# EAGLE schematic ecg_2017 (EAGLE 7.6.0)
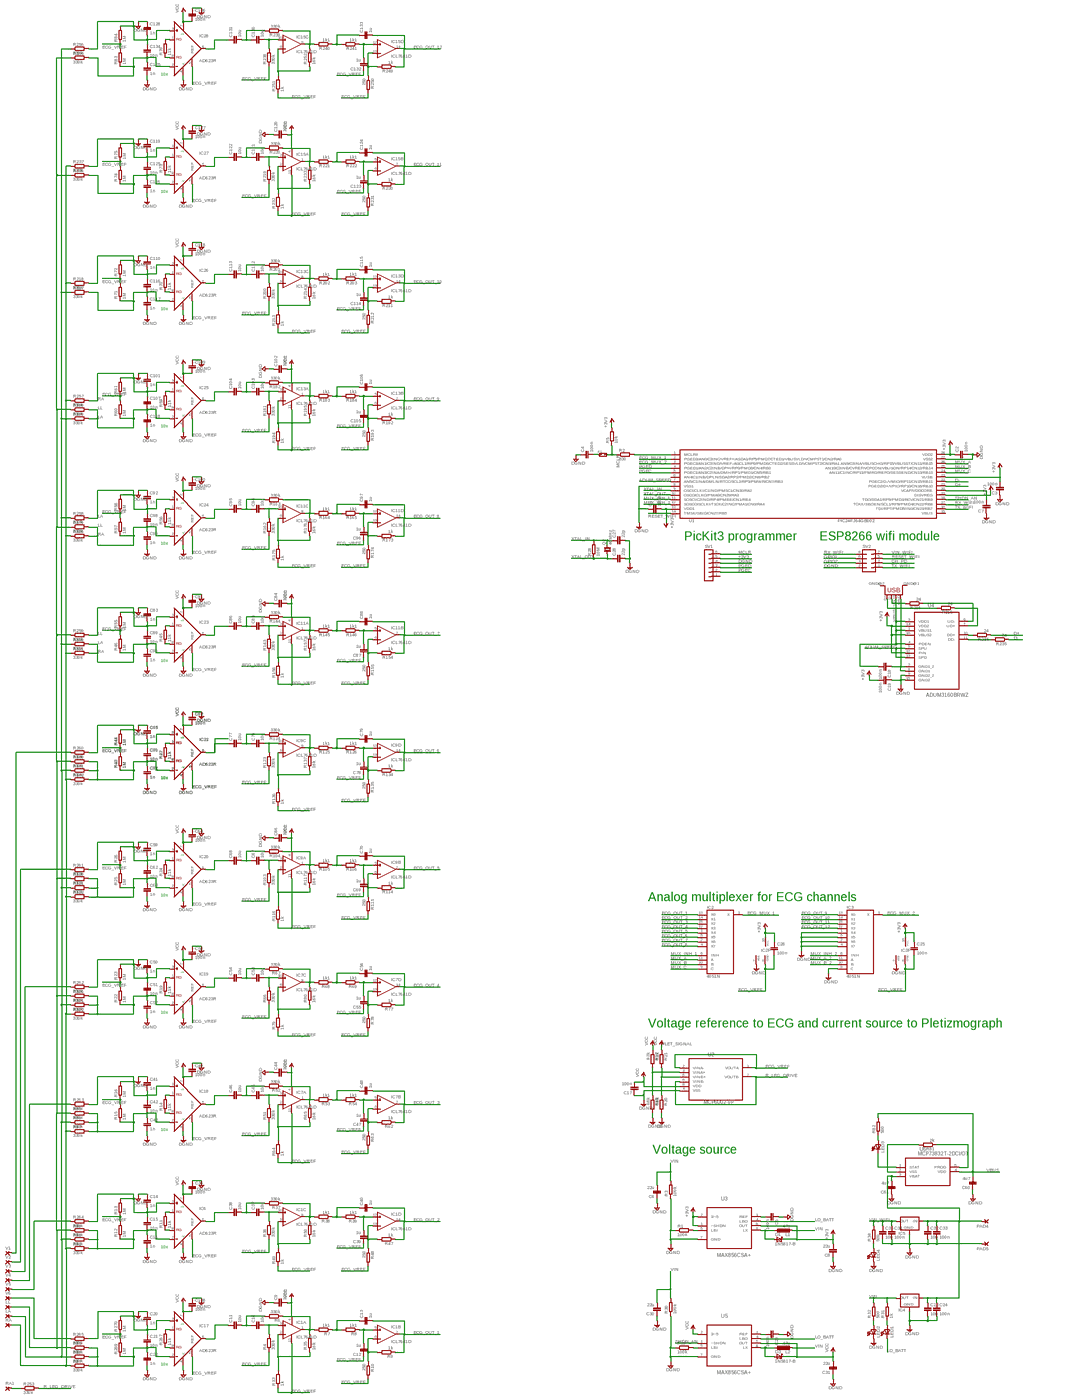
[diagram p0: schematic, sheet 1, overview]
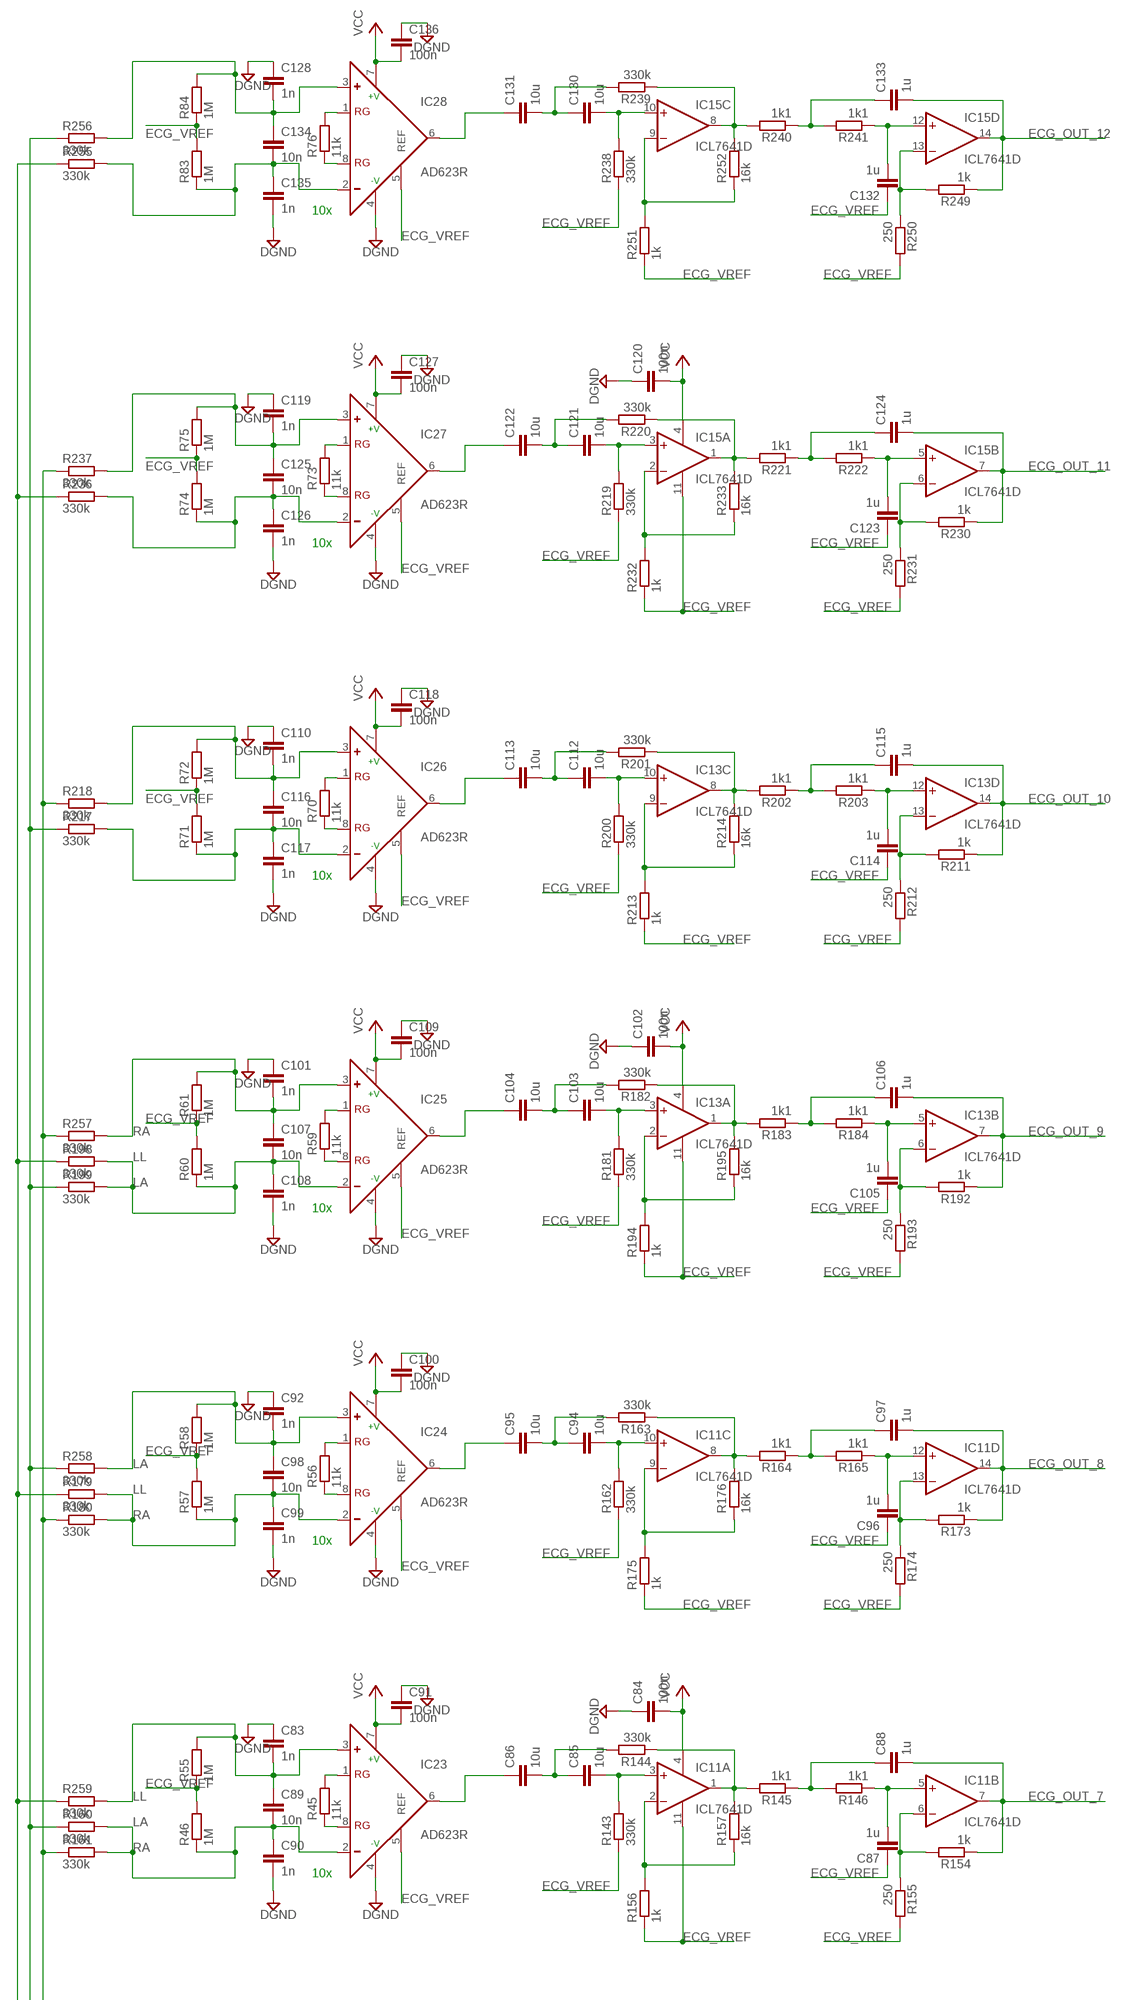
[diagram p1: schematic, sheet 1, part 1 of 4]
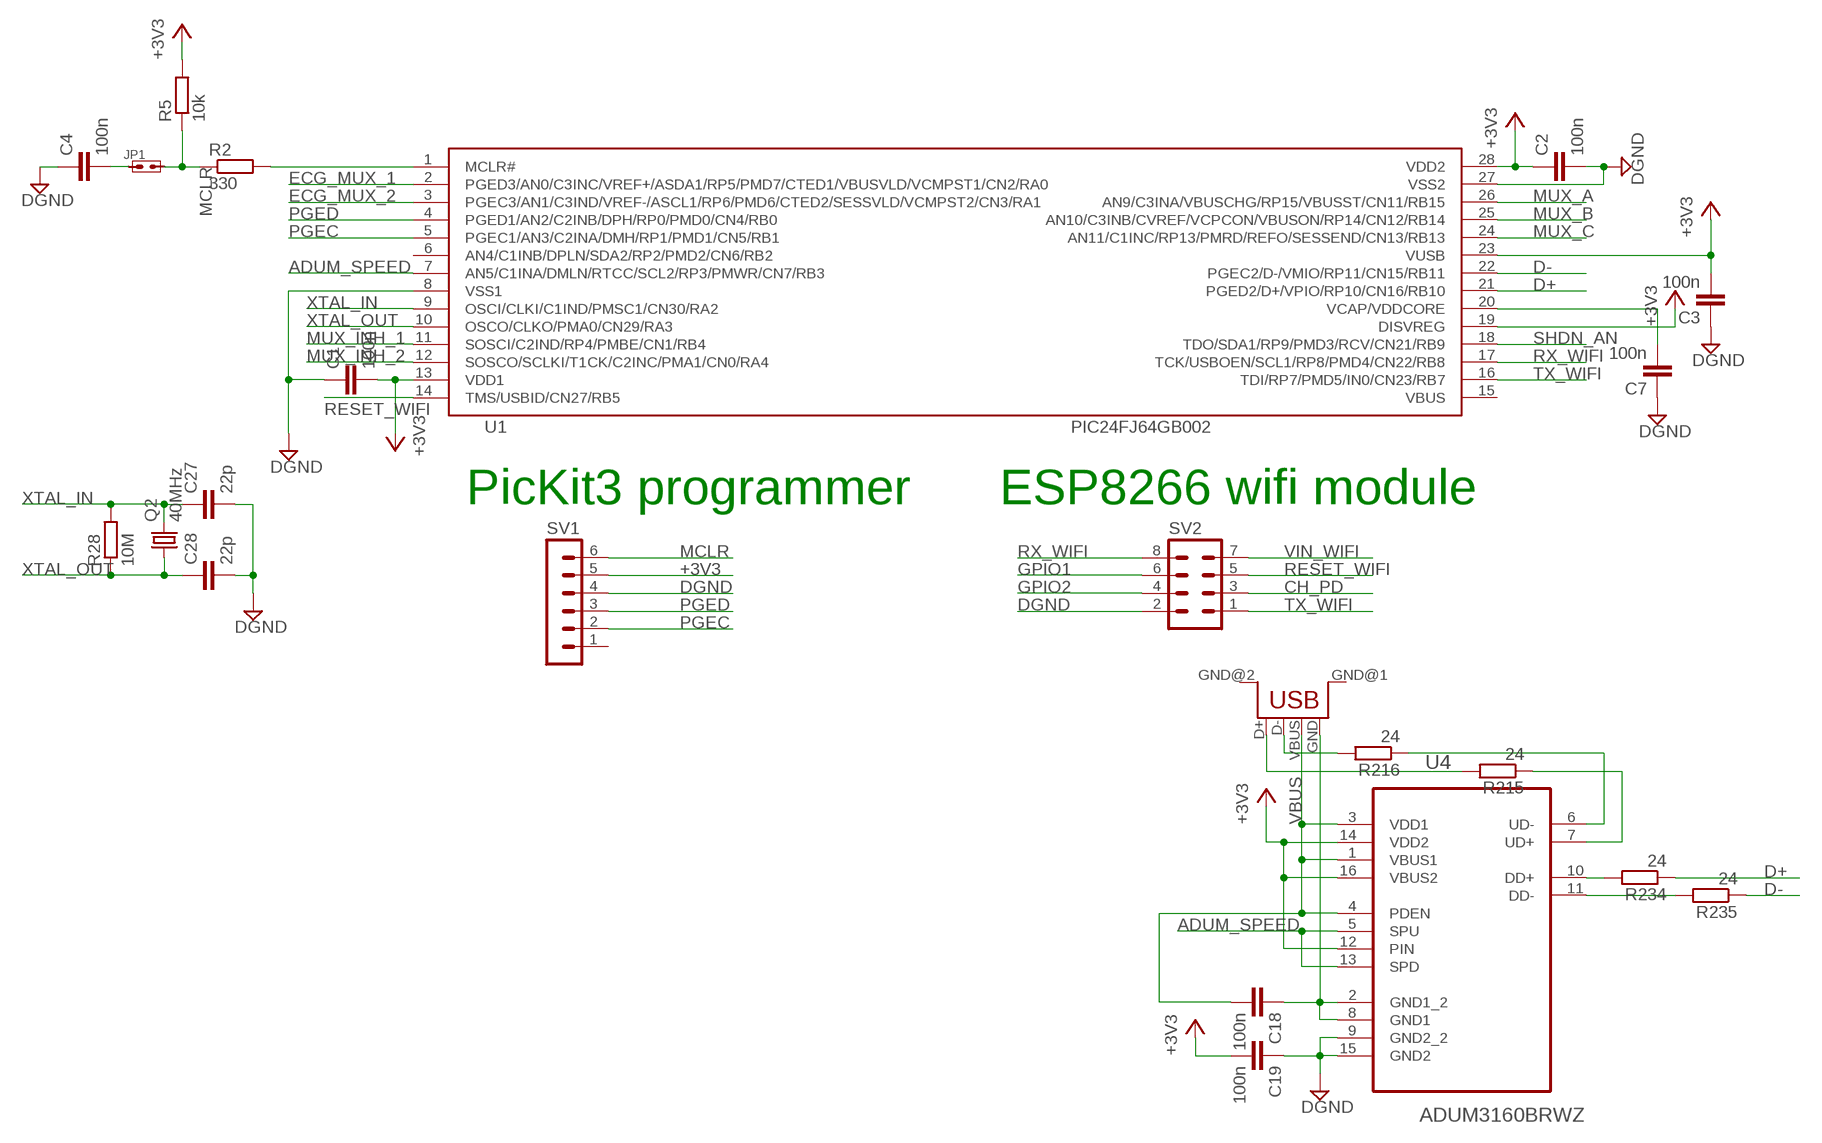
[diagram p2: schematic, sheet 1, part 2 of 4]
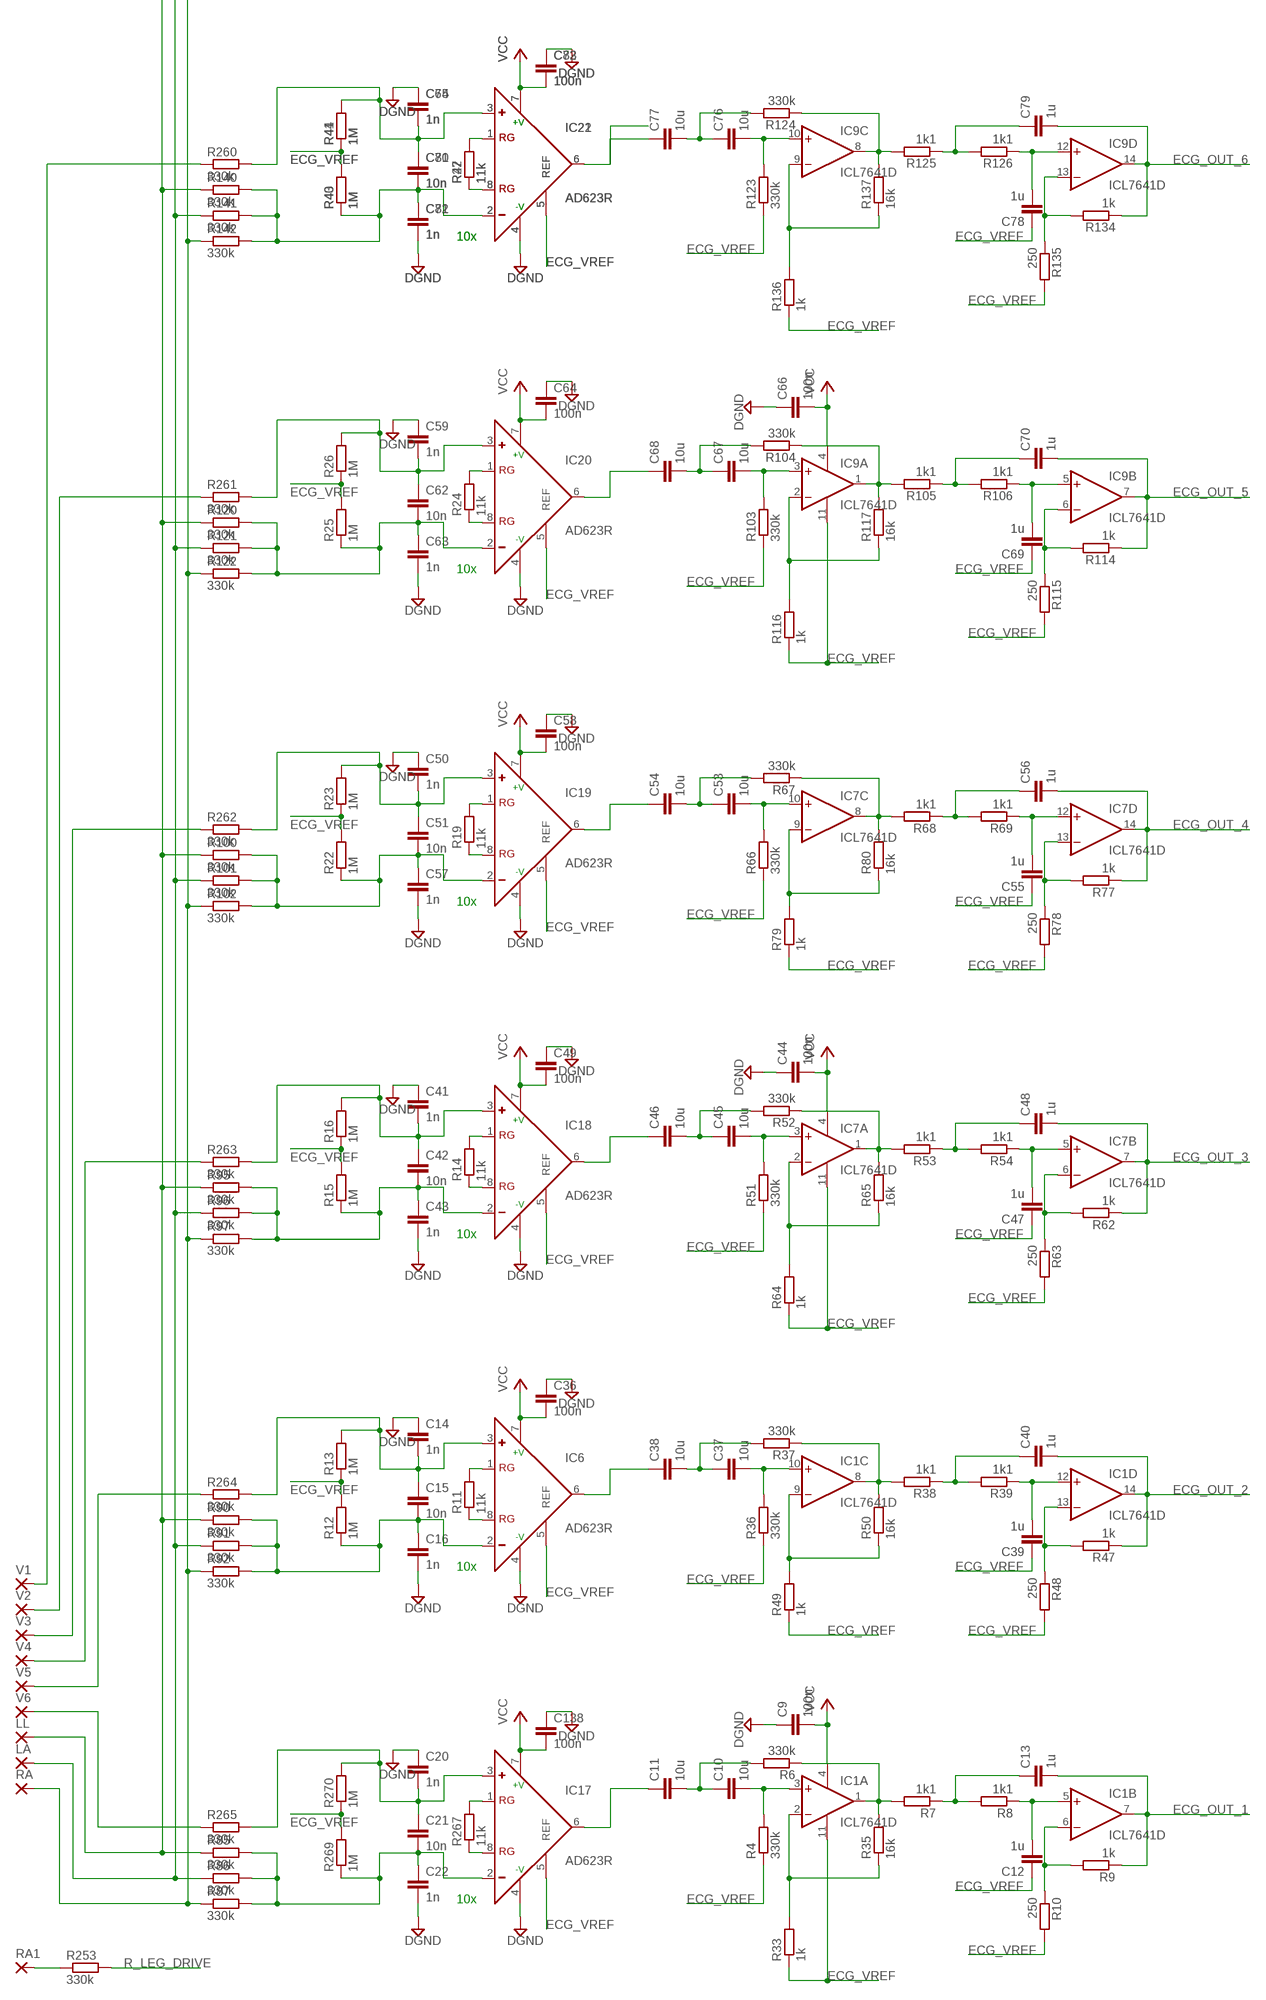
[diagram p3: schematic, sheet 1, part 3 of 4]
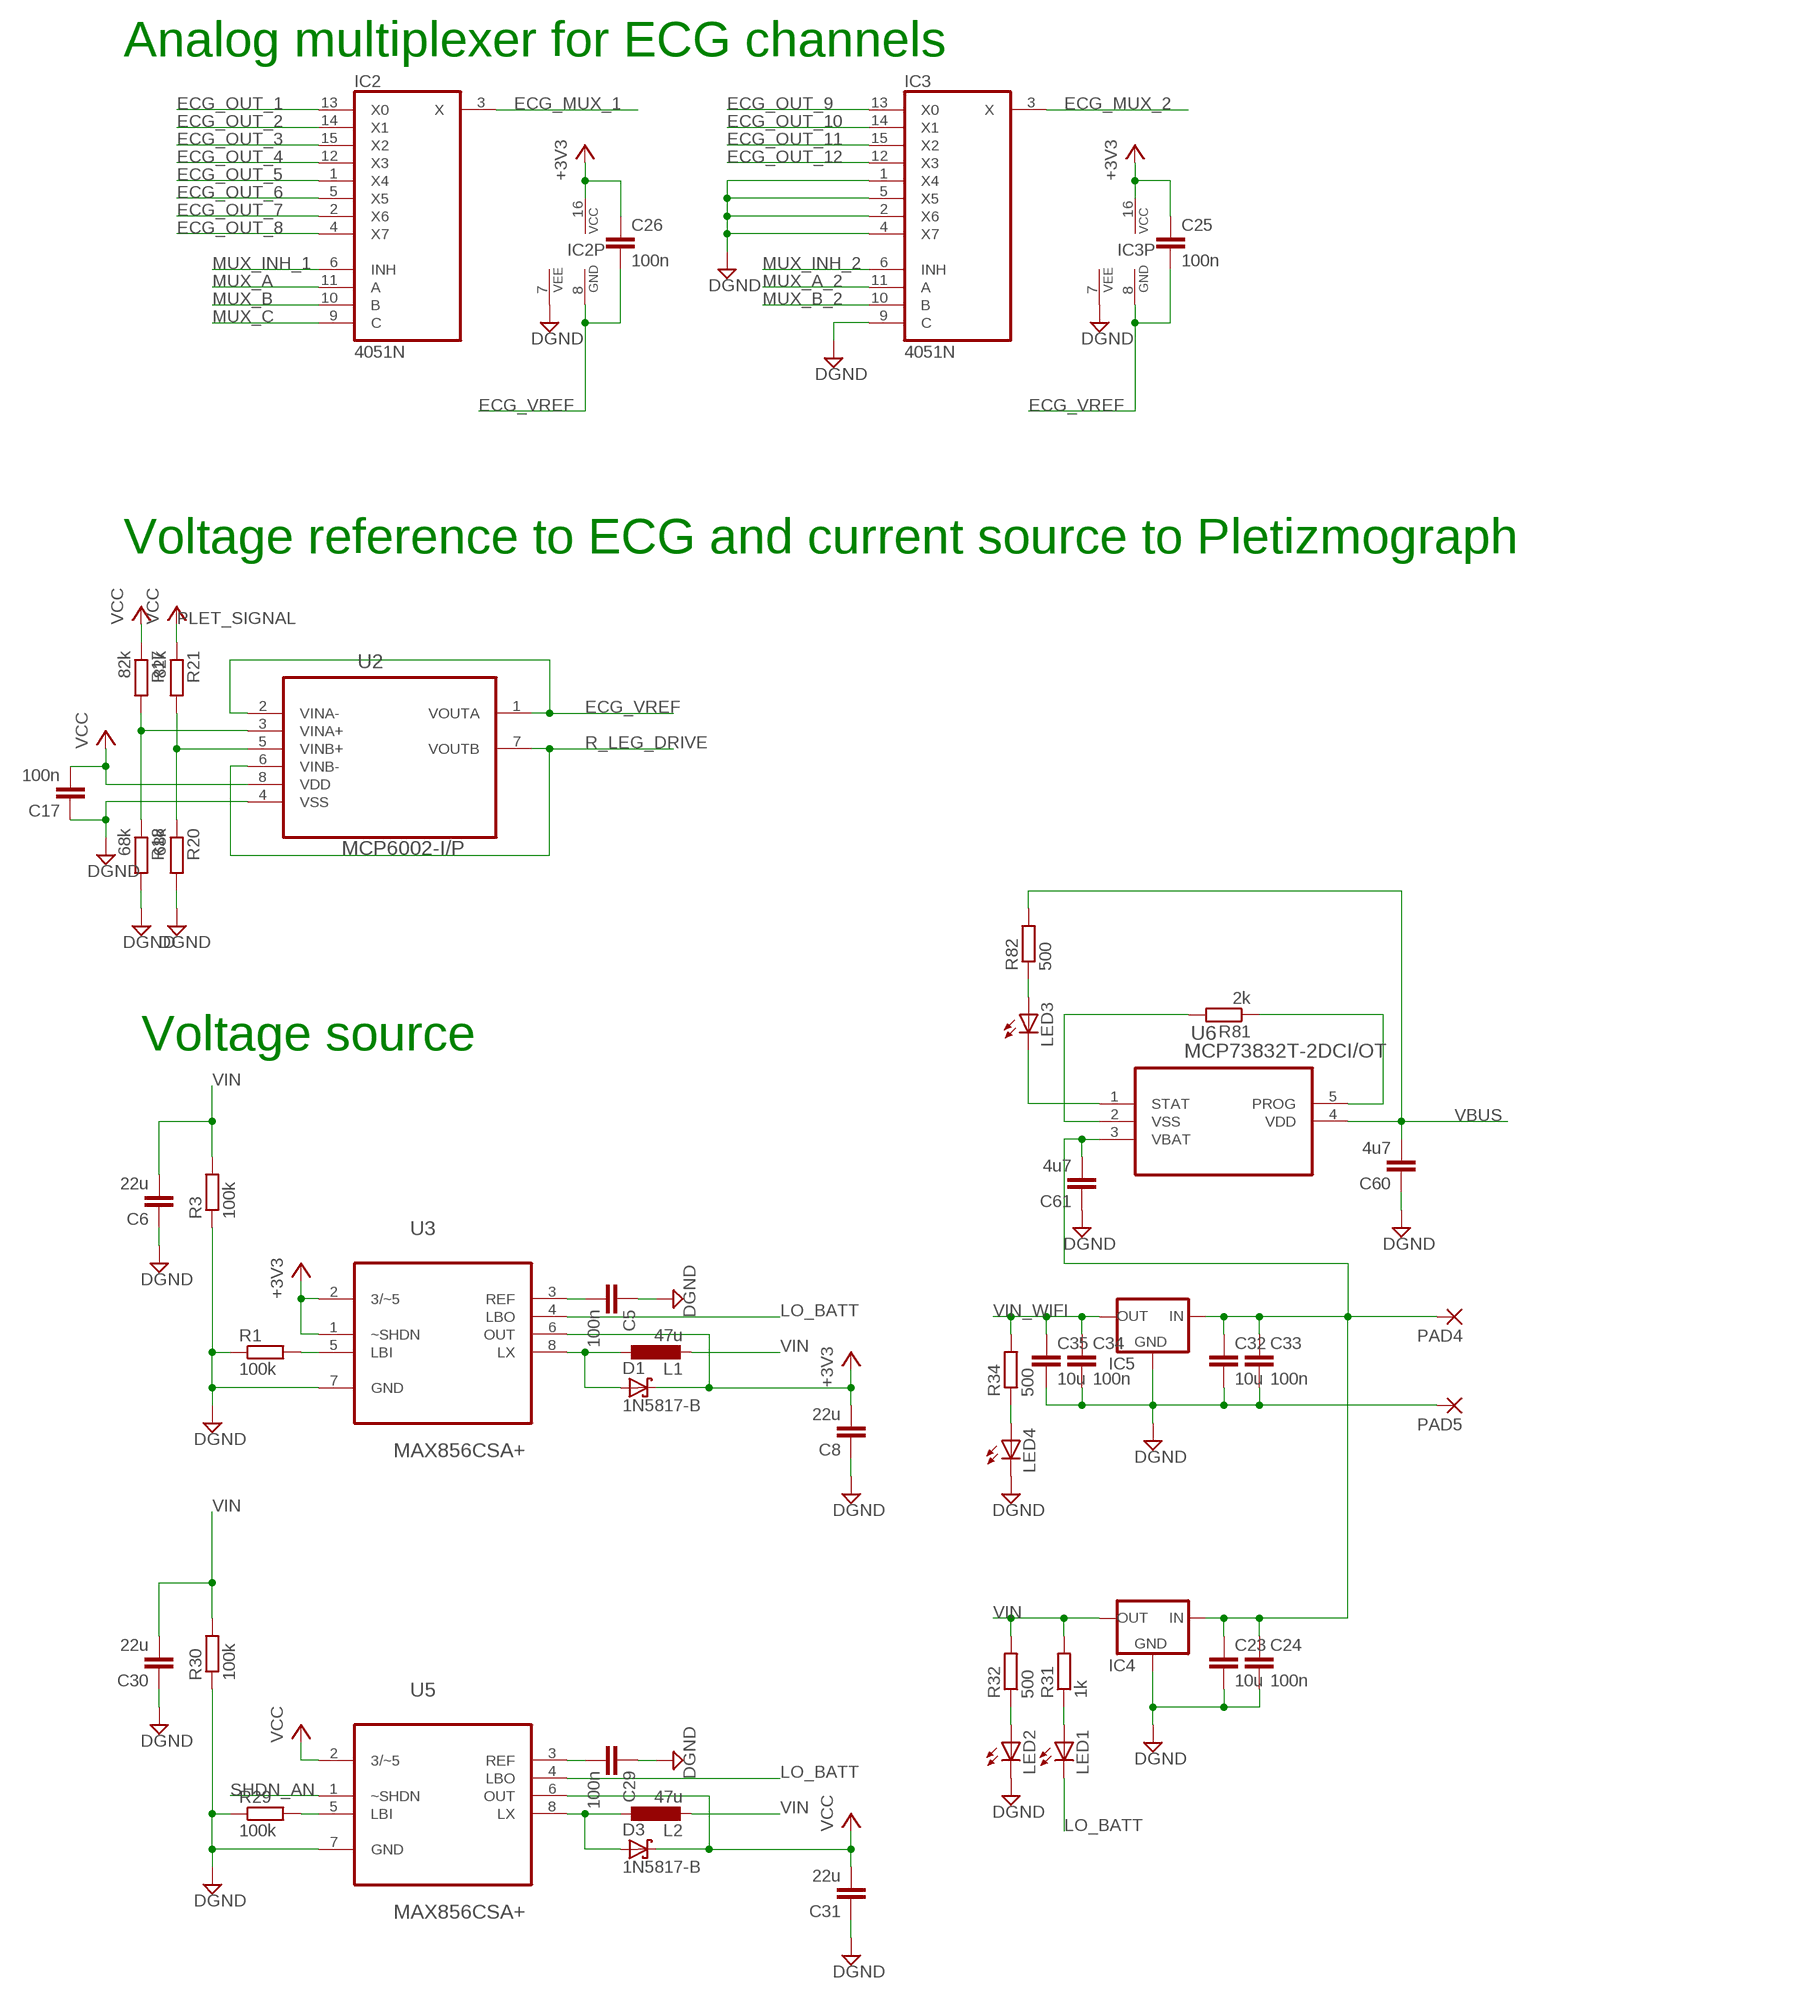
[diagram p4: schematic, sheet 1, part 4 of 4]

## Parts
C1  100n  C-EUC0805  [C0805]
C2  100n  C-EUC0805  [C0805]
C3  100n  C-EUC0805  [C0805]
C4  100n  C-EUC0805  [C0805]
C5  100n  C-EUC0805  [C0805]
C6  22u  C-EUC0805  [C0805]
C7  100n  C-EUC0805  [C0805]
C8  22u  C-EUC0805  [C0805]
C9  100n  C-EUC0805  [C0805]
C10  10u  C-EUC0805  [C0805]
C11  10u  C-EUC0805  [C0805]
C12  1u  C-EUC0805  [C0805]
C13  1u  C-EUC0805  [C0805]
C14  1n  C0805  [C0805]
C15  10n  C0805  [C0805]
C16  1n  C0805  [C0805]
C17  100n  C-EUC0805  [C0805]
C18  100n  C-EUC0805  [C0805]
C19  100n  C-EUC0805  [C0805]
C20  1n  C0805  [C0805]
C21  10n  C0805  [C0805]
C22  1n  C0805  [C0805]
C23  10u  C-EUC0805  [C0805]
C24  100n  C-EUC0805  [C0805]
C25  100n  C-EUC0805  [C0805]
C26  100n  C-EUC0805  [C0805]
C27  22p  C-EUC0805  [C0805]
C28  22p  C-EUC0805  [C0805]
C29  100n  C-EUC0805  [C0805]
C30  22u  C-EUC0805  [C0805]
C31  22u  C-EUC0805  [C0805]
C32  10u  C-EUC0805  [C0805]
C33  100n  C-EUC0805  [C0805]
C34  100n  C-EUC0805  [C0805]
C35  10u  C-EUC0805  [C0805]
C36  100n  C0805  [C0805]
C37  10u  C-EUC0805  [C0805]
C38  10u  C-EUC0805  [C0805]
C39  1u  C-EUC0805  [C0805]
C40  1u  C-EUC0805  [C0805]
C41  1n  C0805  [C0805]
C42  10n  C0805  [C0805]
C43  1n  C0805  [C0805]
C44  100n  C-EUC0805  [C0805]
C45  10u  C-EUC0805  [C0805]
C46  10u  C-EUC0805  [C0805]
C47  1u  C-EUC0805  [C0805]
C48  1u  C-EUC0805  [C0805]
C49  100n  C0805  [C0805]
C50  1n  C0805  [C0805]
C51  10n  C0805  [C0805]
C53  10u  C-EUC0805  [C0805]
C54  10u  C-EUC0805  [C0805]
C55  1u  C-EUC0805  [C0805]
C56  1u  C-EUC0805  [C0805]
C57  1n  C0805  [C0805]
C58  100n  C0805  [C0805]
C59  1n  C0805  [C0805]
C60  4u7  C-EUC0805  [C0805]
C61  4u7  C-EUC0805  [C0805]
C62  10n  C0805  [C0805]
C63  1n  C0805  [C0805]
C64  100n  C0805  [C0805]
C65  1n  C0805  [C0805]
C66  100n  C-EUC0805  [C0805]
C67  10u  C-EUC0805  [C0805]
C68  10u  C-EUC0805  [C0805]
C69  1u  C-EUC0805  [C0805]
C70  1u  C-EUC0805  [C0805]
C71  10n  C0805  [C0805]
C72  1n  C0805  [C0805]
C73  100n  C0805  [C0805]
C74  1n  C0805  [C0805]
C76  10u  C-EUC0805  [C0805]
C77  10u  C-EUC0805  [C0805]
C78  1u  C-EUC0805  [C0805]
C79  1u  C-EUC0805  [C0805]
C80  10n  C0805  [C0805]
C81  1n  C0805  [C0805]
C82  100n  C0805  [C0805]
C83  1n  C0805  [C0805]
C84  100n  C-EUC0805  [C0805]
C85  10u  C-EUC0805  [C0805]
C86  10u  C-EUC0805  [C0805]
C87  1u  C-EUC0805  [C0805]
C88  1u  C-EUC0805  [C0805]
C89  10n  C0805  [C0805]
C90  1n  C0805  [C0805]
C91  100n  C0805  [C0805]
C92  1n  C0805  [C0805]
C94  10u  C-EUC0805  [C0805]
C95  10u  C-EUC0805  [C0805]
C96  1u  C-EUC0805  [C0805]
C97  1u  C-EUC0805  [C0805]
C98  10n  C0805  [C0805]
C99  1n  C0805  [C0805]
C100  100n  C0805  [C0805]
C101  1n  C0805  [C0805]
C102  100n  C-EUC0805  [C0805]
C103  10u  C-EUC0805  [C0805]
C104  10u  C-EUC0805  [C0805]
C105  1u  C-EUC0805  [C0805]
C106  1u  C-EUC0805  [C0805]
C107  10n  C0805  [C0805]
C108  1n  C0805  [C0805]
C109  100n  C0805  [C0805]
C110  1n  C0805  [C0805]
C112  10u  C-EUC0805  [C0805]
C113  10u  C-EUC0805  [C0805]
C114  1u  C-EUC0805  [C0805]
C115  1u  C-EUC0805  [C0805]
C116  10n  C0805  [C0805]
C117  1n  C0805  [C0805]
C118  100n  C0805  [C0805]
C119  1n  C0805  [C0805]
C120  100n  C-EUC0805  [C0805]
C121  10u  C-EUC0805  [C0805]
C122  10u  C-EUC0805  [C0805]
C123  1u  C-EUC0805  [C0805]
C124  1u  C-EUC0805  [C0805]
C125  10n  C0805  [C0805]
C126  1n  C0805  [C0805]
C127  100n  C0805  [C0805]
C128  1n  C0805  [C0805]
C130  10u  C-EUC0805  [C0805]
C131  10u  C-EUC0805  [C0805]
C132  1u  C-EUC0805  [C0805]
C133  1u  C-EUC0805  [C0805]
C134  10n  C0805  [C0805]
C135  1n  C0805  [C0805]
C136  100n  C0805  [C0805]
C138  100n  C0805  [C0805]
CON2  USB  [USB-FEMALE-A-PTH]
D1  1N5817-B  [DO41-7.6]
D3  1N5817-B  [DO41-7.6]
IC1  ICL7641D  [SO14]
IC2  4051N  [DIL16]
IC3  4051N  [DIL16]
IC4  R-783.3-0.5  [R-78XX]
IC5  R-783.3-0.5  [R-78XX]
IC6  AD623R  [SO8]
IC7  ICL7641D  [SO14]
IC9  ICL7641D  [SO14]
IC11  ICL7641D  [SO14]
IC13  ICL7641D  [SO14]
IC15  ICL7641D  [SO14]
IC17  AD623R  [SO8]
IC18  AD623R  [SO8]
IC19  AD623R  [SO8]
IC20  AD623R  [SO8]
IC21  AD623R  [SO8]
IC22  AD623R  [SO8]
IC23  AD623R  [SO8]
IC24  AD623R  [SO8]
IC25  AD623R  [SO8]
IC26  AD623R  [SO8]
IC27  AD623R  [SO8]
IC28  AD623R  [SO8]
JP1  JMP2  [JP2]
L1  47u  L-EUL1812  [L1812]
L2  47u  L-EUL1812  [L1812]
LA  2,54/1,0  [2,54/1,0]
LED1  LEDSML0805  [SML0805]
LED2  LEDSML0805  [SML0805]
LED3  LEDSML0805  [SML0805]
LED4  LEDSML0805  [SML0805]
LL  2,54/1,0  [2,54/1,0]
PAD4  2,54/1,0  [2,54/1,0]
PAD5  2,54/1,0  [2,54/1,0]
Q2  40MHz  CRYSTALTC26V  [TC26V]
R1  100k  R0805  [R0805]
R2  330  R0805  [R0805]
R3  100k  R0805  [R0805]
R4  330k  R0805  [R0805]
R5  10k  R0805  [R0805]
R6  330k  R0805  [R0805]
R7  1k1  R0805  [R0805]
R8  1k1  R0805  [R0805]
R9  1k  R0805  [R0805]
R10  250  R0805  [R0805]
R11  11k  R0805  [R0805]
R12  1M  R0805  [R0805]
R13  1M  R0805  [R0805]
R14  11k  R0805  [R0805]
R15  1M  R0805  [R0805]
R16  1M  R0805  [R0805]
R17  82k  R0805  [R0805]
R18  68k  R0805  [R0805]
R19  11k  R0805  [R0805]
R20  68k  R0805  [R0805]
R21  82k  R0805  [R0805]
R22  1M  R0805  [R0805]
R23  1M  R0805  [R0805]
R24  11k  R0805  [R0805]
R25  1M  R0805  [R0805]
R26  1M  R0805  [R0805]
R27  11k  R0805  [R0805]
R28  10M  R-EU_M0805  [M0805]
R29  100k  R0805  [R0805]
R30  100k  R0805  [R0805]
R31  1k  R0805  [R0805]
R32  500  R0805  [R0805]
R33  1k  R0805  [R0805]
R34  500  R0805  [R0805]
R35  16k  R0805  [R0805]
R36  330k  R0805  [R0805]
R37  330k  R0805  [R0805]
R38  1k1  R0805  [R0805]
R39  1k1  R0805  [R0805]
R40  1M  R0805  [R0805]
R41  1M  R0805  [R0805]
R42  11k  R0805  [R0805]
R43  1M  R0805  [R0805]
R44  1M  R0805  [R0805]
R45  11k  R0805  [R0805]
R46  1M  R0805  [R0805]
R47  1k  R0805  [R0805]
R48  250  R0805  [R0805]
R49  1k  R0805  [R0805]
R50  16k  R0805  [R0805]
R51  330k  R0805  [R0805]
R52  330k  R0805  [R0805]
R53  1k1  R0805  [R0805]
R54  1k1  R0805  [R0805]
R55  1M  R0805  [R0805]
R56  11k  R0805  [R0805]
R57  1M  R0805  [R0805]
R58  1M  R0805  [R0805]
R59  11k  R0805  [R0805]
R60  1M  R0805  [R0805]
R61  1M  R0805  [R0805]
R62  1k  R0805  [R0805]
R63  250  R0805  [R0805]
R64  1k  R0805  [R0805]
R65  16k  R0805  [R0805]
R66  330k  R0805  [R0805]
R67  330k  R0805  [R0805]
R68  1k1  R0805  [R0805]
R69  1k1  R0805  [R0805]
R70  11k  R0805  [R0805]
R71  1M  R0805  [R0805]
R72  1M  R0805  [R0805]
R73  11k  R0805  [R0805]
R74  1M  R0805  [R0805]
R75  1M  R0805  [R0805]
R76  11k  R0805  [R0805]
R77  1k  R0805  [R0805]
R78  250  R0805  [R0805]
R79  1k  R0805  [R0805]
R80  16k  R0805  [R0805]
R81  2k  R0805  [R0805]
R82  500  R0805  [R0805]
R83  1M  R0805  [R0805]
R84  1M  R0805  [R0805]
R85  330k  R0805  [R0805]
R86  330k  R0805  [R0805]
R87  330k  R0805  [R0805]
R90  330k  R0805  [R0805]
R91  330k  R0805  [R0805]
R92  330k  R0805  [R0805]
R95  330k  R0805  [R0805]
R96  330k  R0805  [R0805]
R97  330k  R0805  [R0805]
R100  330k  R0805  [R0805]
R101  330k  R0805  [R0805]
R102  330k  R0805  [R0805]
R103  330k  R0805  [R0805]
R104  330k  R0805  [R0805]
R105  1k1  R0805  [R0805]
R106  1k1  R0805  [R0805]
R114  1k  R0805  [R0805]
R115  250  R0805  [R0805]
R116  1k  R0805  [R0805]
R117  16k  R0805  [R0805]
R120  330k  R0805  [R0805]
R121  330k  R0805  [R0805]
R122  330k  R0805  [R0805]
R123  330k  R0805  [R0805]
R124  330k  R0805  [R0805]
R125  1k1  R0805  [R0805]
R126  1k1  R0805  [R0805]
R134  1k  R0805  [R0805]
R135  250  R0805  [R0805]
R136  1k  R0805  [R0805]
R137  16k  R0805  [R0805]
R140  330k  R0805  [R0805]
R141  330k  R0805  [R0805]
R142  330k  R0805  [R0805]
R143  330k  R0805  [R0805]
R144  330k  R0805  [R0805]
R145  1k1  R0805  [R0805]
R146  1k1  R0805  [R0805]
R154  1k  R0805  [R0805]
R155  250  R0805  [R0805]
R156  1k  R0805  [R0805]
R157  16k  R0805  [R0805]
R160  330k  R0805  [R0805]
R161  330k  R0805  [R0805]
R162  330k  R0805  [R0805]
R163  330k  R0805  [R0805]
R164  1k1  R0805  [R0805]
R165  1k1  R0805  [R0805]
R173  1k  R0805  [R0805]
R174  250  R0805  [R0805]
R175  1k  R0805  [R0805]
R176  16k  R0805  [R0805]
R179  330k  R0805  [R0805]
R180  330k  R0805  [R0805]
R181  330k  R0805  [R0805]
R182  330k  R0805  [R0805]
R183  1k1  R0805  [R0805]
R184  1k1  R0805  [R0805]
R192  1k  R0805  [R0805]
R193  250  R0805  [R0805]
R194  1k  R0805  [R0805]
R195  16k  R0805  [R0805]
R198  330k  R0805  [R0805]
R199  330k  R0805  [R0805]
R200  330k  R0805  [R0805]
R201  330k  R0805  [R0805]
R202  1k1  R0805  [R0805]
R203  1k1  R0805  [R0805]
R211  1k  R0805  [R0805]
R212  250  R0805  [R0805]
R213  1k  R0805  [R0805]
R214  16k  R0805  [R0805]
R215  24  R0805  [R0805]
R216  24  R0805  [R0805]
R217  330k  R0805  [R0805]
R218  330k  R0805  [R0805]
R219  330k  R0805  [R0805]
R220  330k  R0805  [R0805]
R221  1k1  R0805  [R0805]
R222  1k1  R0805  [R0805]
R230  1k  R0805  [R0805]
R231  250  R0805  [R0805]
R232  1k  R0805  [R0805]
R233  16k  R0805  [R0805]
R234  24  R0805  [R0805]
R235  24  R0805  [R0805]
R236  330k  R0805  [R0805]
R237  330k  R0805  [R0805]
R238  330k  R0805  [R0805]
R239  330k  R0805  [R0805]
R240  1k1  R0805  [R0805]
R241  1k1  R0805  [R0805]
R249  1k  R0805  [R0805]
R250  250  R0805  [R0805]
R251  1k  R0805  [R0805]
R252  16k  R0805  [R0805]
R253  330k  R0805  [R0805]
R255  330k  R0805  [R0805]
R256  330k  R0805  [R0805]
R257  330k  R0805  [R0805]
R258  330k  R0805  [R0805]
R259  330k  R0805  [R0805]
R260  330k  R0805  [R0805]
R261  330k  R0805  [R0805]
R262  330k  R0805  [R0805]
R263  330k  R0805  [R0805]
R264  330k  R0805  [R0805]
R265  330k  R0805  [R0805]
R267  11k  R0805  [R0805]
R269  1M  R0805  [R0805]
R270  1M  R0805  [R0805]
RA  2,54/1,0  [2,54/1,0]
RA1  2,54/1,0  [2,54/1,0]
SV1  MA06-1  [MA06-1]
SV2  MA04-2  [MA04-2]
U1  PIC24FJ64GB002  [DIP28]
U2  MCP6002-I/P  [DIP254P762X533-8]
U3  MAX856CSA+  [SOIC127P600X175-8N]
U4  ADUM3160BRWZ  [SOIC127P1032X265-16N]
U5  MAX856CSA+  [SOIC127P600X175-8N]
U6  MCP73832T-2DCI/OT  [SOT95P300X145-5N]
V1  2,54/1,0  [2,54/1,0]
V2  2,54/1,0  [2,54/1,0]
V3  2,54/1,0  [2,54/1,0]
V4  2,54/1,0  [2,54/1,0]
V5  2,54/1,0  [2,54/1,0]
V6  2,54/1,0  [2,54/1,0]

## Nets
+3V3: C1.2 C2.1 C3.2 C8.2 C19.2 C25.1 C26.1 D1.C IC2.16(VCC) IC3.16(VCC) R5.2 SV1.5 U1.13(VDD1) U1.19(DISVREG) U1.23(VUSB) U1.28(VDD2) U3.1(~SHDN) U3.2(3/~5) U3.6(OUT) U4.12(PIN) U4.14(VDD2) U4.16(VBUS2)
ADUM_SPEED: U1.7(AN5/C1INA/DMLN/RTCC/SCL2/RP3/PMWR/CN7/RB3) U4.5(SPU) U4.13(SPD)
CH_PD: SV2.3
D+: R234.1 U1.21(PGED2/D+/VPIO/RP10/CN16/RB10)
D-: R235.1 U1.22(PGEC2/D-/VMIO/RP11/CN15/RB11)
DGND: C1.1 C2.2 C3.1 C4.1 C5.1 C6.1 C7.1 C8.1 C9.1 C14.2 C16.1 C17.1 C19.1 C20.2 C22.1 C23.2 C24.2 C27.2 C28.2 C29.1 C30.1 C31.1 C32.2 C33.2 C34.2 C35.2 C36.2 C41.2 C43.1 C44.1 C49.2 C50.2 C57.1 C58.2 C59.2 C60.1 C61.1 C63.1 C64.2 C65.2 C66.1 C72.1 C73.2 C74.2 C81.1 C82.2 C83.2 C84.1 C90.1 C91.2 C92.2 C99.1 C100.2 C101.2 C102.1 C108.1 C109.2 C110.2 C117.1 C118.2 C119.2 C120.1 C126.1 C127.2 C128.2 C135.1 C136.2 C138.2 IC2.7(VEE) IC3.1(X4) IC3.2(X6) IC3.4(X7) IC3.5(X5) IC3.7(VEE) IC3.9(C) IC4.GND IC5.GND IC6.4(-V) IC17.4(-V) IC18.4(-V) IC19.4(-V) IC20.4(-V) IC21.4(-V) IC22.4(-V) IC23.4(-V) IC24.4(-V) IC25.4(-V) IC26.4(-V) IC27.4(-V) IC28.4(-V) LED2.C LED4.C PAD5.1(P) R1.1 R3.1 R18.2 R20.2 R29.1 R30.1 SV1.4 SV2.2 U1.8(VSS1) U1.27(VSS2) U2.4(VSS) U3.7(GND) U4.9(GND2_2) U4.15(GND2) U5.7(GND)
ECG_MUX_1: IC2.3(X) U1.2(PGED3/AN0/C3INC/VREF+/ASDA1/RP5/PMD7/CTED1/VBUSVLD/VCMPST1/CN2/RA0)
ECG_MUX_2: IC3.3(X) U1.3(PGEC3/AN1/C3IND/VREF-/ASCL1/RP6/PMD6/CTED2/SESSVLD/VCMPST2/CN3/RA1)
ECG_OUT_1: C13.2 IC1.7(B:OUT) IC2.13(X0) R9.1
ECG_OUT_2: C40.2 IC1.14(D:OUT) IC2.14(X1) R47.1
ECG_OUT_3: C48.2 IC2.15(X2) IC7.7(B:OUT) R62.1
ECG_OUT_4: C56.2 IC2.12(X3) IC7.14(D:OUT) R77.1
ECG_OUT_5: C70.2 IC2.1(X4) IC9.7(B:OUT) R114.1
ECG_OUT_6: C79.2 IC2.5(X5) IC9.14(D:OUT) R134.1
ECG_OUT_7: C88.2 IC2.2(X6) IC11.7(B:OUT) R154.1
ECG_OUT_8: C97.2 IC2.4(X7) IC11.14(D:OUT) R173.1
ECG_OUT_9: C106.2 IC3.13(X0) IC13.7(B:OUT) R192.1
ECG_OUT_10: C115.2 IC3.14(X1) IC13.14(D:OUT) R211.1
ECG_OUT_11: C124.2 IC3.15(X2) IC15.7(B:OUT) R230.1
ECG_OUT_12: C133.2 IC3.12(X3) IC15.14(D:OUT) R249.1
ECG_VREF: C12.1 C25.2 C26.2 C39.1 C47.1 C55.1 C69.1 C78.1 C87.1 C96.1 C105.1 C114.1 C123.1 C132.1 IC1.11(P:V-) IC2.8(GND) IC3.8(GND) IC6.5(REF) IC7.11(P:V-) IC9.11(P:V-) IC11.11(P:V-) IC13.11(P:V-) IC15.11(P:V-) IC17.5(REF) IC18.5(REF) IC19.5(REF) IC20.5(REF) IC21.5(REF) IC22.5(REF) IC23.5(REF) IC24.5(REF) IC25.5(REF) IC26.5(REF) IC27.5(REF) IC28.5(REF) R4.1 R10.2 R12.2 R13.1 R15.2 R16.1 R22.2 R23.1 R25.2 R26.1 R33.1 R36.1 R40.2 R41.1 R43.2 R44.1 R46.2 R48.2 R49.1 R51.1 R55.1 R57.2 R58.1 R60.2 R61.1 R63.2 R64.1 R66.1 R71.2 R72.1 R74.2 R75.1 R78.2 R79.1 R83.2 R84.1 R103.1 R115.2 R116.1 R123.1 R135.2 R136.1 R143.1 R155.2 R156.1 R162.1 R174.2 R175.1 R181.1 R193.2 R194.1 R200.1 R212.2 R213.1 R219.1 R231.2 R232.1 R238.1 R250.2 R251.1 R269.2 R270.1 U2.1(VOUTA) U2.2(VINA-)
GPIO1: SV2.6
GPIO2: SV2.4
LA: LA.1(P) R86.1 R91.1 R96.1 R101.1 R121.1 R141.1 R160.1 R199.1 R217.1 R256.1 R258.1
LL: LL.1(P) R85.1 R90.1 R95.1 R100.1 R120.1 R140.1 R179.1 R198.1 R236.1 R255.1 R259.1
LO_BATT: LED1.C U3.4(LBO) U5.4(LBO)
MCLR: JP1.2 R2.1 R5.1 SV1.6
MUX_A: IC2.11(A) U1.26(AN9/C3INA/VBUSCHG/RP15/VBUSST/CN11/RB15)
MUX_A_2: IC3.11(A)
MUX_B: IC2.10(B) U1.25(AN10/C3INB/CVREF/VCPCON/VBUSON/RP14/CN12/RB14)
MUX_B_2: IC3.10(B)
MUX_C: IC2.9(C) U1.24(AN11/C1INC/RP13/PMRD/REFO/SESSEND/CN13/RB13)
MUX_INH_1: IC2.6(INH) U1.11(SOSCI/C2IND/RP4/PMBE/CN1/RB4)
MUX_INH_2: IC3.6(INH) U1.12(SOSCO/SCLKI/T1CK/C2INC/PMA1/CN0/RA4)
N$1: C5.2 U3.3(REF)
N$2: R1.2 U3.5(LBI)
N$3: C10.2 IC1.3(A:+IN) R4.2
N$4: D1.A L1.1 U3.8(LX)
N$5: C10.1 C11.2 R6.2
N$6: IC1.2(A:-IN) R33.2 R35.1
N$7: C13.1 R7.1 R8.2
N$8: C12.2 IC1.5(B:+IN) R8.1
N$9: IC6.8(RG) R11.1
N$10: C4.2 JP1.1
N$11: R2.2 U1.1(MCLR#)
N$12: IC6.1(RG) R11.2
N$13: C134.1 C135.2 IC28.2(-) R83.1 R255.2
N$14: C14.1 C15.2 IC6.3(+) R13.2 R264.2
N$15: C38.1 IC6.6(OUT)
N$16: IC18.8(RG) R14.1
N$17: IC18.1(RG) R14.2
N$18: R17.2 R18.1 U2.3(VINA+)
N$19: IC17.8(RG) R267.1
N$20: IC1.6(B:-IN) R9.2 R10.1
N$21: C41.1 C42.2 IC18.3(+) R16.2 R263.2
N$22: C29.2 U5.3(REF)
N$23: C46.1 IC18.6(OUT)
N$24: IC19.8(RG) R19.1
N$25: C23.1 C24.1 C32.1 C33.1 C61.2 IC4.IN IC5.IN PAD4.1(P) U6.3(VBAT)
N$26: R81.1 U6.5(PROG)
N$27: R81.2 U6.2(VSS)
N$28: LED3.A R82.1
N$29: LED3.C U6.1(STAT)
N$30: IC19.1(RG) R19.2
N$31: C50.1 C51.2 IC19.3(+) R23.2 R262.2
N$32: C54.1 IC19.6(OUT)
N$33: IC28.8(RG) R76.1
N$34: IC20.8(RG) R24.1
N$35: IC20.1(RG) R24.2
N$36: C59.1 C62.2 IC20.3(+) R26.2 R261.2
N$37: C68.1 IC20.6(OUT)
N$38: R29.2 U5.5(LBI)
N$39: C7.2 U1.20(VCAP/VDDCORE)
N$40: D3.A L2.1 U5.8(LX)
N$41: LED1.A R31.1
N$42: LED2.A R32.1
N$43: C37.2 IC1.10(C:+IN) R36.2
N$44: IC1.1(A:OUT) R6.1 R7.2 R35.2
N$45: LED4.A R34.1
N$46: C37.1 C38.2 R37.2
N$47: C40.1 R38.1 R39.2
N$48: C39.2 IC1.12(D:+IN) R39.1
N$49: IC28.1(RG) R76.2
N$50: IC21.8(RG) R27.1
N$51: IC21.1(RG) R27.2
N$52: C65.1 C71.2 IC21.3(+) R41.2 R260.2
N$53: C77.1 IC21.6(OUT)
N$54: IC17.1(RG) R267.2
N$55: C80.1 C81.2 IC22.2(-) R43.1
N$56: C89.1 C90.2 IC23.2(-) R46.1 R160.2 R161.2
N$57: IC1.13(D:-IN) R47.2 R48.1
N$58: IC1.8(C:OUT) R37.1 R38.2 R50.2
N$59: IC1.9(C:-IN) R49.2 R50.1
N$60: C45.2 IC7.3(A:+IN) R51.2
N$61: C45.1 C46.2 R52.2
N$62: C48.1 R53.1 R54.2
N$63: C47.2 IC7.5(B:+IN) R54.1
N$64: C98.1 C99.2 IC24.2(-) R57.1 R179.2 R180.2
N$65: C107.1 C108.2 IC25.2(-) R60.1 R198.2 R199.2
N$66: C116.1 C117.2 IC26.2(-) R71.1 R217.2
N$67: C125.1 C126.2 IC27.2(-) R74.1 R236.2
N$68: IC22.8(RG) R42.1
N$69: IC22.1(RG) R42.2
N$70: C74.1 C80.2 IC22.3(+) R44.2
N$71: IC22.6(OUT)
N$72: IC7.6(B:-IN) R62.2 R63.1
N$73: IC7.1(A:OUT) R52.1 R53.2 R65.2
N$74: IC7.2(A:-IN) R64.2 R65.1
N$75: C53.2 IC7.10(C:+IN) R66.2
N$76: C53.1 C54.2 R67.2
N$77: C56.1 R68.1 R69.2
N$78: C55.2 IC7.12(D:+IN) R69.1
N$80: IC23.8(RG) R45.1
N$81: IC23.1(RG) R45.2
N$82: C83.1 C89.2 IC23.3(+) R55.2 R259.2
N$83: C86.1 IC23.6(OUT)
N$84: C20.1 C21.2 IC17.3(+) R265.2 R270.2
N$85: IC24.8(RG) R56.1
N$86: IC24.1(RG) R56.2
N$87: IC7.13(D:-IN) R77.2 R78.1
N$88: IC7.8(C:OUT) R67.1 R68.2 R80.2
N$89: IC7.9(C:-IN) R79.2 R80.1
N$90: C21.1 C22.2 IC17.2(-) R85.2 R86.2 R87.2 R269.1
N$91: C128.1 C134.2 IC28.3(+) R84.2 R256.2
N$92: C112.2 IC13.10(C:+IN) R200.2
N$93: C112.1 C113.2 R201.2
N$94: R265.1 V6.1(P)
N$95: C92.1 C98.2 IC24.3(+) R58.2 R258.2
N$96: C15.1 C16.2 IC6.2(-) R12.1 R90.2 R91.2 R92.2
N$97: R264.1 V5.1(P)
N$98: C18.1 CON2.GND U4.2(GND1_2) U4.8(GND1)
N$99: C95.1 IC24.6(OUT)
N$100: C76.2 IC9.10(C:+IN) R123.2
N$101: R263.1 V4.1(P)
N$102: R216.1 U4.6(UD-)
N$103: R215.1 U4.7(UD+)
N$104: R262.1 V3.1(P)
N$105: C42.1 C43.2 IC18.2(-) R15.1 R95.2 R96.2 R97.2
N$106: C51.1 C57.2 IC19.2(-) R22.1 R100.2 R101.2 R102.2
N$107: C76.1 C77.2 R124.2
N$108: C67.2 IC9.3(A:+IN) R103.2
N$109: C67.1 C68.2 R104.2
N$110: C70.1 R105.1 R106.2
N$111: C69.2 IC9.5(B:+IN) R106.1
N$113: IC25.8(RG) R59.1
N$114: IC25.1(RG) R59.2
N$115: C101.1 C107.2 IC25.3(+) R61.2 R257.2
N$116: C104.1 IC25.6(OUT)
N$117: C11.1 IC17.6(OUT)
N$118: IC26.8(RG) R70.1
N$119: IC26.1(RG) R70.2
N$120: IC9.6(B:-IN) R114.2 R115.1
N$121: IC9.1(A:OUT) R104.1 R105.2 R117.2
N$122: IC9.2(A:-IN) R116.2 R117.1
N$123: CON2.D- R216.2
N$124: R234.2 U4.10(DD+)
N$125: C110.1 C116.2 IC26.3(+) R72.2 R218.2
N$126: C62.1 C63.2 IC20.2(-) R25.1 R120.2 R121.2 R122.2
N$127: C79.1 R125.1 R126.2
N$128: C78.2 IC9.12(D:+IN) R126.1
N$130: C113.1 IC26.6(OUT)
N$131: IC27.8(RG) R73.1
N$132: IC27.1(RG) R73.2
N$133: C119.1 C125.2 IC27.3(+) R75.2 R237.2
N$134: C122.1 IC27.6(OUT)
N$135: C131.1 IC28.6(OUT)
N$137: IC9.13(D:-IN) R134.2 R135.1
N$138: IC9.8(C:OUT) R124.1 R125.2 R137.2
N$139: IC9.9(C:-IN) R136.2 R137.1
N$140: CON2.D+ R215.2
N$141: R235.2 U4.11(DD-)
N$142: R260.1 V1.1(P)
N$143: C71.1 C72.2 IC21.2(-) R40.1 R140.2 R141.2 R142.2
N$144: R261.1 V2.1(P)
N$145: C94.2 IC11.10(C:+IN) R162.2
N$146: C85.2 IC11.3(A:+IN) R143.2
N$147: C85.1 C86.2 R144.2
N$148: C88.1 R145.1 R146.2
N$149: C87.2 IC11.5(B:+IN) R146.1
N$158: IC11.6(B:-IN) R154.2 R155.1
N$159: IC11.1(A:OUT) R144.1 R145.2 R157.2
N$160: IC11.2(A:-IN) R156.2 R157.1
N$161: R253.1 RA1.1(P)
N$163: C94.1 C95.2 R163.2
N$164: C115.1 R202.1 R203.2
N$165: C97.1 R164.1 R165.2
N$166: C96.2 IC11.12(D:+IN) R165.1
N$175: IC11.13(D:-IN) R173.2 R174.1
N$176: IC11.8(C:OUT) R163.1 R164.2 R176.2
N$177: IC11.9(C:-IN) R175.2 R176.1
N$180: C103.2 IC13.3(A:+IN) R181.2
N$182: C103.1 C104.2 R182.2
N$183: C106.1 R183.1 R184.2
N$184: C105.2 IC13.5(B:+IN) R184.1
N$193: IC13.6(B:-IN) R192.2 R193.1
N$194: IC13.1(A:OUT) R182.1 R183.2 R195.2
N$195: IC13.2(A:-IN) R194.2 R195.1
N$198: C114.2 IC13.12(D:+IN) R203.1
N$208: IC13.13(D:-IN) R211.2 R212.1
N$209: IC13.8(C:OUT) R201.1 R202.2 R214.2
N$210: IC13.9(C:-IN) R213.2 R214.1
N$213: C121.2 IC15.3(A:+IN) R219.2
N$214: C121.1 C122.2 R220.2
N$215: C124.1 R221.1 R222.2
N$216: C123.2 IC15.5(B:+IN) R222.1
N$225: IC15.6(B:-IN) R230.2 R231.1
N$226: IC15.1(A:OUT) R220.1 R221.2 R233.2
N$227: IC15.2(A:-IN) R232.2 R233.1
N$231: C130.2 IC15.10(C:+IN) R238.2
N$232: C130.1 C131.2 R239.2
N$233: C133.1 R240.1 R241.2
N$234: C132.2 IC15.12(D:+IN) R241.1
N$243: IC15.13(D:-IN) R249.2 R250.1
N$244: IC15.8(C:OUT) R239.1 R240.2 R252.2
N$245: IC15.9(C:-IN) R251.2 R252.1
PGEC: SV1.2 U1.5(PGEC1/AN3/C2INA/DMH/RP1/PMD1/CN5/RB1)
PGED: SV1.3 U1.4(PGED1/AN2/C2INB/DPH/RP0/PMD0/CN4/RB0)
PLET_SIGNAL: R20.1 R21.2 U2.5(VINB+)
R_LEG_DRIVE: R253.2 U2.6(VINB-) U2.7(VOUTB)
RA: R87.1 R92.1 R97.1 R102.1 R122.1 R142.1 R161.1 R180.1 R218.1 R237.1 R257.1 RA.1(P)
RESET_WIFI: SV2.5 U1.14(TMS/USBID/CN27/RB5)
RX_WIFI: SV2.8 U1.17(TCK/USBOEN/SCL1/RP8/PMD4/CN22/RB8)
SHDN_AN: U1.18(TDO/SDA1/RP9/PMD3/RCV/CN21/RB9) U5.1(~SHDN)
TX_WIFI: SV2.1 U1.16(TDI/RP7/PMD5/IN0/CN23/RB7)
VBUS: C18.2 C60.2 CON2.VBUS R82.2 U4.1(VBUS1) U4.3(VDD1) U4.4(PDEN) U6.4(VDD)
VCC: C9.2 C17.2 C31.2 C36.1 C44.2 C49.1 C58.1 C64.1 C66.2 C73.1 C82.1 C84.2 C91.1 C100.1 C102.2 C109.1 C118.1 C120.2 C127.1 C136.1 C138.1 D3.C IC1.4(P:V+) IC6.7(+V) IC7.4(P:V+) IC9.4(P:V+) IC11.4(P:V+) IC13.4(P:V+) IC15.4(P:V+) IC17.7(+V) IC18.7(+V) IC19.7(+V) IC20.7(+V) IC21.7(+V) IC22.7(+V) IC23.7(+V) IC24.7(+V) IC25.7(+V) IC26.7(+V) IC27.7(+V) IC28.7(+V) R17.1 R21.1 U2.8(VDD) U5.2(3/~5) U5.6(OUT)
VIN: C6.2 C30.2 IC4.OUT L1.2 L2.2 R3.2 R30.2 R31.2 R32.2
VIN_WIFI: C34.1 C35.1 IC5.OUT R34.2 SV2.7
XTAL_IN: C27.1 Q2.2 R28.2 U1.9(OSCI/CLKI/C1IND/PMSC1/CN30/RA2)
XTAL_OUT: C28.1 Q2.1 R28.1 U1.10(OSCO/CLKO/PMA0/CN29/RA3)
Unconnected: CON2.GND@1(GND) CON2.GND@2(GND) SV1.1 U1.6(AN4/C1INB/DPLN/SDA2/RP2/PMD2/CN6/RB2)

## Notes on the sheet
- 10x
- 10x
- 10x
- 10x
- PicKit3 programmer | ESP8266 wifi module
- 10x
- 10x
- 10x | 10x
- 10x
- Analog multiplexer for ECG channels
- 10x
- Voltage reference to ECG and current source to Pletizmograph
- 10x
- Voltage source
- 10x
- 10x

## Power pins joined to a net without a drawn wire
VBUS: U1.15(VBUS)

## Library data of the parts
C1-C13 C17-C19 C23-C35 C37-C40 C44-C48 C53-C56 C60 C61 C66-C70 C76-C79 C84-C88 C94-C97 C102-C106 C112-C115 C120-C124 C130-C133 = resistor:C-EU: CAPACITOR, European symbol
C14-C16 C20-C22 C36 C41-C43 C49-C51 C57-C59 C62-C65 C71-C74 C80-C83 C89-C92 C98-C101 C107-C110 C116-C119 C125-C128 C134-C136 C138 = Zoli:C: Capacitor
CON2 = STUNTAZ:USB: USB Connectors USB-FEMALE-A-PTH: Through hole Female Type A Connector
D1 D3 = diode:1N581*: 1.0A SCHOTTKY BARRIER RECTIFIER Source: http://www.diodes.com/datasheets/ds23001.pdf
IC1 IC7 IC9 IC11 IC13 IC15 = linear:ICL7641: OP AMP
IC2 IC3 = 40xx:4051: 8-channel ANALOG MULTIPLEXER
IC4 IC5 = Zoli2:R-78*: VOLTAGE REGULATOR
IC6 IC17-IC28 = analog-devices:AD623: Single-Supply, Rail-to-Rail, Low Cost Instrumentation Amplifier Source: http://www.analog.com/static/imported-files/data_sheets/AD623.pdf
JP1 = Zoli:JMP2
L1 L2 = resistor:L-EU: INDUCTOR, European symbol
LA LL PAD4 PAD5 RA RA1 V1-V6 = wirepad:2,54/1,0: THROUGH-HOLE PAD
LED1-LED4 = led:LED: LED OSRAM: - CHIPLED LG R971, LG N971, LY N971, LG Q971, LY Q971, LO R971, LY R971 LH N974, LH R974 LS Q976, LO Q976, LY Q976 LO Q996 - Hyper CHIPLED LW Q18S LB Q993, LB Q99A, LB R99A - SideLED LS A670, LO A670, LY A670, LG A670, LP A670 LB A673, LV A673, LT A673, LW A673 LH A674 LY A675 LS A676, LA A676, LO A676, LY A676, LW A676 LS A679, LY A679, LG A679 - Hyper Micro SIDELED® LS Y876, LA Y876, LO Y876, LY Y876 LT Y87S - SmartLED LW L88C, LW L88S LB L89C, LB L89S, LG L890 LS L89K, LO L89K, LY L89K LS L896, LA L896, LO L896, LY L896 - TOPLED LS T670, LO T670, LY T670, LG T670, LP T670 LSG T670, LSP T670, LSY T670, LOP T670, LYG T670 LG T671, LOG T671, LSG T671 LB T673, LV T673, LT T673, LW T673 LH T674 LS T676, LA T676, LO T676, LY T676, LB T676, LH T676, LSB T676, LW T676 LB T67C, LV T67C, LT T67C, LS T67K, LO T67K, LY T67K, LW E67C LS E67B, LA E67B, LO E67B, LY E67B, LB E67C, LV E67C, LT E67C LW T67C LS T679, LY T679, LG T679 LS T770, LO T770, LY T770, LG T770, LP T770 LB T773, LV T773, LT T773, LW T773 LH T774 LS E675, LA E675, LY E675, LS T675 LS T776, LA T776, LO T776, LY T776, LB T776 LHGB T686 LT T68C, LB T68C - Hyper Mini TOPLED® LB M676 - Mini TOPLED Santana® LG M470 LS M47K, LO M47K, LY M47K Source: http://www.osram.convergy.de LUXEON: - LUMILED® LXK2-PW12-R00, LXK2-PW12-S00, LXK2-PW14-U00, LXK2-PW14-V00 LXK2-PM12-R00, LXK2-PM12-S00, LXK2-PM14-U00 LXK2-PE12-Q00, LXK2-PE12-R00, LXK2-PE12-S00, LXK2-PE14-T00, LXK2-PE14-U00 LXK2-PB12-K00, LXK2-PB12-L00, LXK2-PB12-M00, LXK2-PB14-N00, LXK2-PB14-P00, LXK2-PB14-Q00 LXK2-PR12-L00, LXK2-PR12-M00, LXK2-PR14-Q00, LXK2-PR14-R00 LXK2-PD12-Q00, LXK2-PD12-R00, LXK2-PD12-S00 LXK2-PH12-R00, LXK2-PH12-S00 LXK2-PL12-P00, LXK2-PL12-Q00, LXK2-PL12-R00 Source: www.luxeon.com KINGBRIGHT: KA-3528ASYC Source: www.kingbright.com
Q2 = crystal:CRYSTAL: CRYSTAL; OC_FARNELL: unknown; OC_NEWARK: unknown
R1-R27 R29-R87 R90-R92 R95-R97 R100-R106 R114-R117 R120-R126 R134-R137 R140-R146 R154-R157 R160-R165 R173-R176 R179-R184 R192-R195 R198-R203 R211-R222 R230-R241 R249-R253 R255-R265 R267 R269 R270 = Zoli:R: Resistor
R28 = resistor:R-EU_: RESISTOR, European symbol
SV1 = con-lstb:MA06-1: PIN HEADER; OC_FARNELL: unknown; OC_NEWARK: unknown
SV2 = con-lstb:MA04-2: PIN HEADER; OC_FARNELL: unknown; OC_NEWARK: unknown
U1 = kimai0827:PIC24FJ64GB002: PIC24FJ64GB002
U2 = Microchip_By_element14_Batch_1:MCP6002-I/P: IC OPAMP 1.8V 1MHZ DUAL; MPN: MCP6002-I/P; OC_FARNELL: 1292245; OC_NEWARK: 96K3734; PACKAGE: PDIP8; SUPPLIER: Microchip
U3 U5 = Maxim_By_element14_Batch_1:MAX856CSA+: Step-Up DC-DC Converters; MPN: MAX856CSA+; OC_FARNELL: 9725040; OC_NEWARK: 67K6793; PACKAGE: SOIC-8; SUPPLIER: Maxim
U4 = Analog Devices_By_element14_Batch_1:ADUM3160BRWZ: Full/Low Speed 2.5 kV USB Digital Isolator; MPN: ADUM3160BRWZ; OC_FARNELL: 1843660; OC_NEWARK: 85R6420; PACKAGE: SOIC-16; SUPPLIER: Analog Devices
U6 = Microchip_By_element14_Batch_1:MCP73832T-2DCI/OT: IC, BATT CHARGER, Li-Ion Li-Polymer, 500 mA; MPN: MCP73832T-2DCI/OT; OC_FARNELL: 1834892; OC_NEWARK: 84R5198; PACKAGE: SOT23-5; SUPPLIER: Microchip